# Altium schematic sheet FPGA2_POWER.SchDoc
size A4
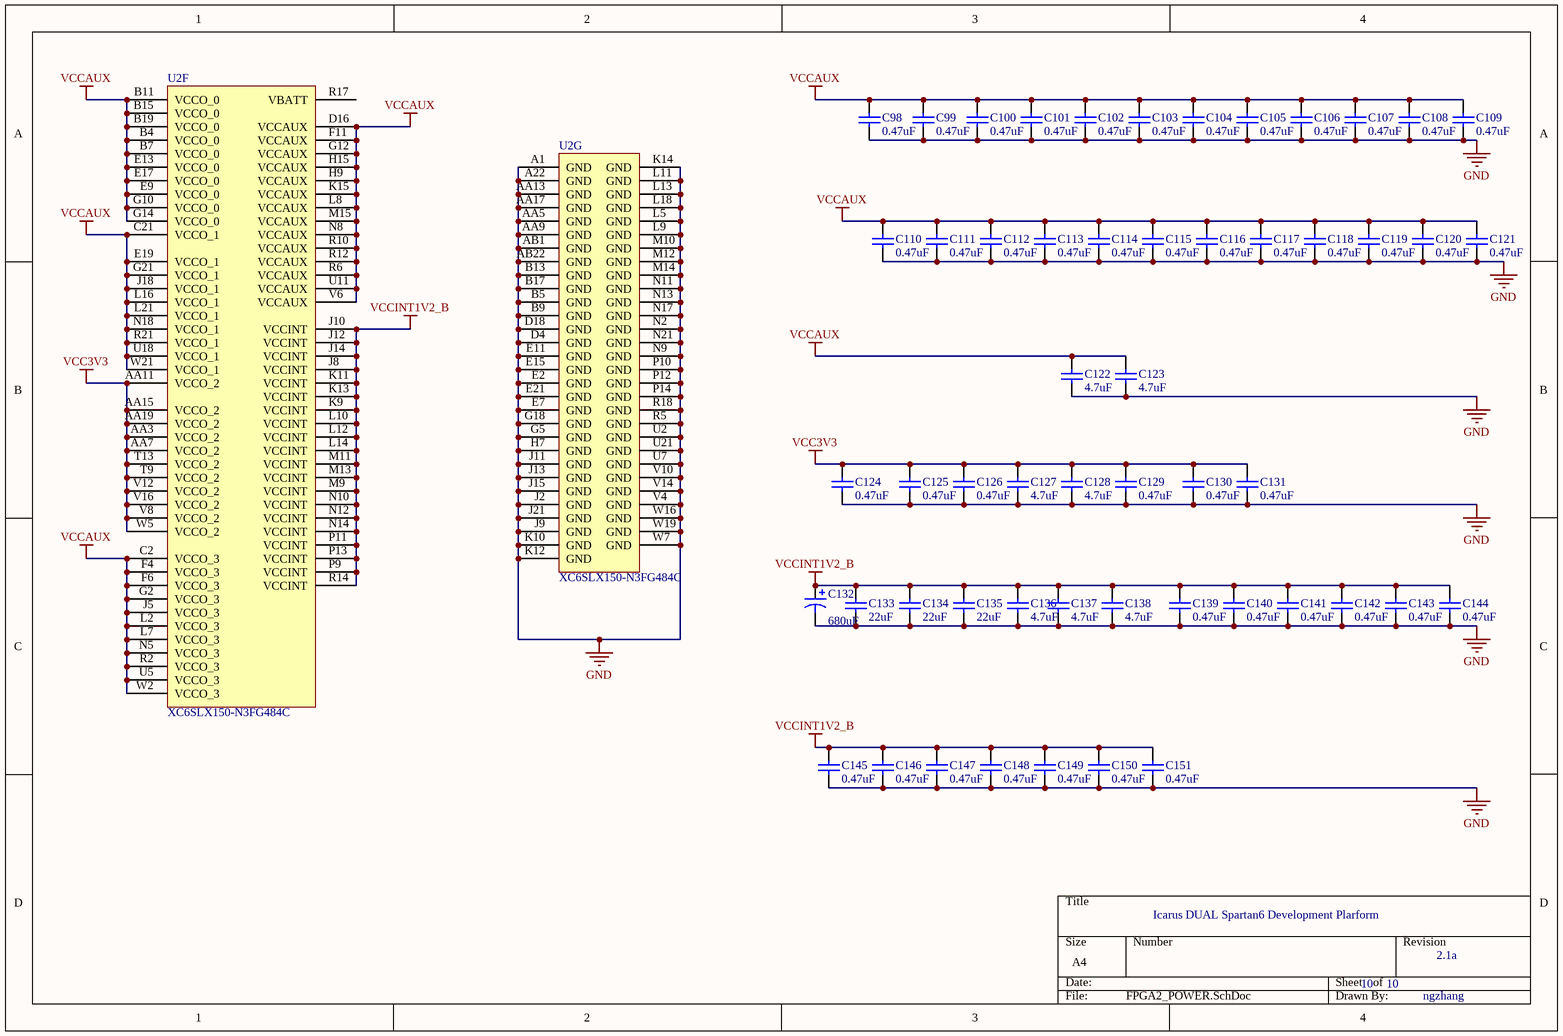
[diagram p0: FPGA2_POWER.SchDoc]

## Parts
C98  0.47uF  [0402]
C99  0.47uF  [0402]
C100  0.47uF  [0402]
C101  0.47uF  [0402]
C102  0.47uF  [0402]
C103  0.47uF  [0402]
C104  0.47uF  [0402]
C105  0.47uF  [0402]
C106  0.47uF  [0402]
C107  0.47uF  [0402]
C108  0.47uF  [0402]
C109  0.47uF  [0402]
C110  0.47uF  [0402]
C111  0.47uF  [0402]
C112  0.47uF  [0402]
C113  0.47uF  [0402]
C114  0.47uF  [0402]
C115  0.47uF  [0402]
C116  0.47uF  [0402]
C117  0.47uF  [0402]
C118  0.47uF  [0402]
C119  0.47uF  [0402]
C120  0.47uF  [0402]
C121  0.47uF  [0402]
C122  4.7uF  [C0805]
C123  4.7uF  [C0805]
C124  0.47uF  [0402]
C125  0.47uF  [0402]
C126  0.47uF  [0402]
C127  4.7uF  [C0805]
C128  4.7uF  [C0805]
C129  0.47uF  [0402]
C130  0.47uF  [0402]
C131  0.47uF  [0402]
C132  680uF  [D]
C133  22uF  [C1206]
C134  22uF  [C1206]
C135  22uF  [C1206]
C136  4.7uF  [C0805]
C137  4.7uF  [C0805]
C138  4.7uF  [C0805]
C139  0.47uF  [0402]
C140  0.47uF  [0402]
C141  0.47uF  [0402]
C142  0.47uF  [0402]
C143  0.47uF  [0402]
C144  0.47uF  [0402]
C145  0.47uF  [0402]
C146  0.47uF  [0402]
C147  0.47uF  [0402]
C148  0.47uF  [0402]
C149  0.47uF  [0402]
C150  0.47uF  [0402]
C151  0.47uF  [0402]
U2  XC6SLX150-N3FG484C  [FG484]  (parts F,G of 7)

## Nets
GND: C98.1 C99.1 C100.1 C101.1 C102.1 C103.1 C104.1 C105.1 C106.1 C107.1 C108.1 C109.1 C110.1 C111.1 C112.1 C113.1 C114.1 C115.1 C116.1 C117.1 C118.1 C119.1 C120.1 C121.1 C122.1 C123.1 C124.1 C125.1 C126.1 C127.1 C128.1 C129.1 C130.1 C131.1 C132.2 C133.1 C134.1 C135.1 C136.1 C137.1 C138.1 C139.1 C140.1 C141.1 C142.1 C143.1 C144.1 C145.1 C146.1 C147.1 C148.1 C149.1 C150.1 C151.1 U2.A1(GND) U2.A22(GND) U2.AA5(GND) U2.AA9(GND) U2.AA13(GND) U2.AA17(GND) U2.AB1(GND) U2.AB22(GND) U2.B5(GND) U2.B9(GND) U2.B13(GND) U2.B17(GND) U2.D4(GND) U2.D18(GND) U2.E2(GND) U2.E7(GND) U2.E11(GND) U2.E15(GND) U2.E21(GND) U2.G5(GND) U2.G18(GND) U2.H7(GND) U2.J2(GND) U2.J9(GND) U2.J11(GND) U2.J13(GND) U2.J15(GND) U2.J21(GND) U2.K10(GND) U2.K12(GND) U2.K14(GND) U2.L5(GND) U2.L9(GND) U2.L11(GND) U2.L13(GND) U2.L18(GND) U2.M10(GND) U2.M12(GND) U2.M14(GND) U2.N2(GND) U2.N9(GND) U2.N11(GND) U2.N13(GND) U2.N17(GND) U2.N21(GND) U2.P10(GND) U2.P12(GND) U2.P14(GND) U2.R5(GND) U2.R18(GND) U2.U2(GND) U2.U7(GND) U2.U21(GND) U2.V4(GND) U2.V10(GND) U2.V14(GND) U2.W7(GND) U2.W16(GND) U2.W19(GND)
VCC3V3: C124.2 C125.2 C126.2 C127.2 C128.2 C129.2 C130.2 C131.2 U2.AA3(VCCO_2) U2.AA7(VCCO_2) U2.AA11(VCCO_2) U2.AA15(VCCO_2) U2.AA19(VCCO_2) U2.T9(VCCO_2) U2.T13(VCCO_2) U2.V8(VCCO_2) U2.V12(VCCO_2) U2.V16(VCCO_2) U2.W5(VCCO_2)
VCCAUX: C98.2 C99.2 C100.2 C101.2 C102.2 C103.2 C104.2 C105.2 C106.2 C107.2 C108.2 C109.2 C110.2 C111.2 C112.2 C113.2 C114.2 C115.2 C116.2 C117.2 C118.2 C119.2 C120.2 C121.2 C122.2 C123.2 U2.B4(VCCO_0) U2.B7(VCCO_0) U2.B11(VCCO_0) U2.B15(VCCO_0) U2.B19(VCCO_0) U2.C2(VCCO_3) U2.C21(VCCO_1) U2.D16(VCCAUX) U2.E9(VCCO_0) U2.E13(VCCO_0) U2.E17(VCCO_0) U2.E19(VCCO_1) U2.F4(VCCO_3) U2.F6(VCCO_3) U2.F11(VCCAUX) U2.G2(VCCO_3) U2.G10(VCCO_0) U2.G12(VCCAUX) U2.G14(VCCO_0) U2.G21(VCCO_1) U2.H9(VCCAUX) U2.H15(VCCAUX) U2.J5(VCCO_3) U2.J18(VCCO_1) U2.K15(VCCAUX) U2.L2(VCCO_3) U2.L7(VCCO_3) U2.L8(VCCAUX) U2.L16(VCCO_1) U2.L21(VCCO_1) U2.M15(VCCAUX) U2.N5(VCCO_3) U2.N8(VCCAUX) U2.N18(VCCO_1) U2.R2(VCCO_3) U2.R6(VCCAUX) U2.R10(VCCAUX) U2.R12(VCCAUX) U2.R21(VCCO_1) U2.U5(VCCO_3) U2.U11(VCCAUX) U2.U18(VCCO_1) U2.V6(VCCAUX) U2.W2(VCCO_3) U2.W21(VCCO_1)
VCCINT1V2_B: C132.1 C133.2 C134.2 C135.2 C136.2 C137.2 C138.2 C139.2 C140.2 C141.2 C142.2 C143.2 C144.2 C145.2 C146.2 C147.2 C148.2 C149.2 C150.2 C151.2 U2.J8(VCCINT) U2.J10(VCCINT) U2.J12(VCCINT) U2.J14(VCCINT) U2.K9(VCCINT) U2.K11(VCCINT) U2.K13(VCCINT) U2.L10(VCCINT) U2.L12(VCCINT) U2.L14(VCCINT) U2.M9(VCCINT) U2.M11(VCCINT) U2.M13(VCCINT) U2.N10(VCCINT) U2.N12(VCCINT) U2.N14(VCCINT) U2.P9(VCCINT) U2.P11(VCCINT) U2.P13(VCCINT) U2.R14(VCCINT)

Not connected (* = marked no-connect by the designer): U2 R17(VBATT)

## Notes on the sheet
- Icarus DUAL Spartan6 Development Plarform
- 10
- 2.1a
- ngzhang

## Library data of the parts
C98-C131 C133-C151 = Cap Semi: Capacitor (Semiconductor SIM Model); Published: 8-Jun-2000; LatestRevisionDate: 29-May-2009; LatestRevisionNote: IPC-7351 Footprint Added.; PackageReference: C1206; Publisher: Altium Limited; PackageDescription: Chip Capacitor
  C98-C121 C124-C126 C129-C131 C139-C151: Value: 0.47uF
  C122 C123 C127 C128 C136-C138: Value: 4.7uF
  C133-C135: Value: 22uF
C132 = Cap Pol3: Polarized Capacitor (Surface Mount); Published: 8-Jun-2000; LatestRevisionDate: 29-May-2009; LatestRevisionNote: IPC-7351 Footprint Added.; PackageReference: C0805; Publisher: Altium Limited; PackageDescription: Chip Capacitor; Value: 680uF
U2 = XC6SLX150-N3FG484C: Spartan-6 LX 1.2V FPGA, 338 User I/Os, 484-Ball Fine-Pitch BGA (1.0mm Pitch), Speed Grade 3N, Commercial Grade; Published: 24-Aug-2010; DatasheetVersion: ver1.6, Nov-2010; PackageVersion: ver1.1, Dec-2008; PackageReference: FG484; Publisher: Altium Limited; PackageDescription: 484-Ball Fine Pitch Ball Grid Array 1.00 mm Pitch (FG484); Code_JEDEC: MS-034-AAJ-1; Code_IPC: BGA100P22X22-484; ComponentLink1Description: Manufacturer Link; ComponentLink1URL: http://www.xilinx.com; ComponentLink2Description: Spartan-6 Datasheet; ComponentLink2URL: http://www.xilinx.com/support/documentation/data_sheets/ds160.pdf; ComponentLink3Description: Spartan-6 Documents; ComponentLink3URL: http://www.xilinx.com/support/documentation/spartan-6.htm; ComponentLink4Description: Xilinx.com Home; ComponentLink4URL: http://www.xilinx.com